# EAGLE schematic basicUno (EAGLE 6.5.0)
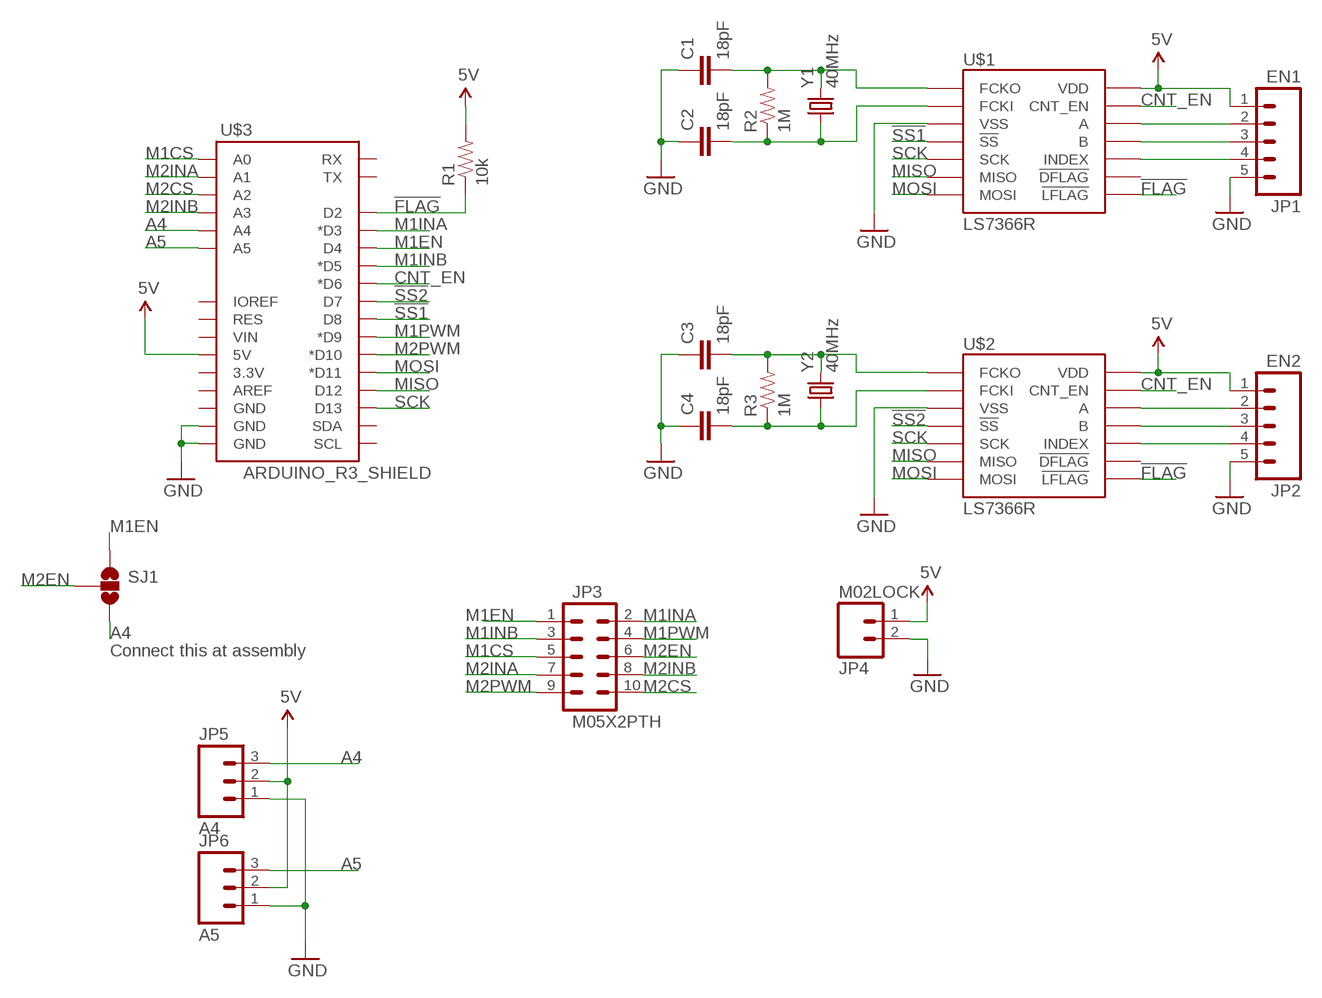
[diagram p0: schematic, sheet 1]

## Parts
C1  18pF  CAP0603-CAP  [0603-CAP]
C2  18pF  CAP0603-CAP  [0603-CAP]
C3  18pF  CAP0603-CAP  [0603-CAP]
C4  18pF  CAP0603-CAP  [0603-CAP]
JP1  EN1  M05LOCK  [1X05_LOCK]
JP2  EN2  M05LOCK  [1X05_LOCK]
JP3  M05X2PTH  [AVR_ICSP]
JP4  M02LOCK  [1X02_LOCK]
JP5  A4  M03LOCK  [1X03_LOCK]
JP6  A5  M03LOCK  [1X03_LOCK]
R1  10k  RESISTORPTH-1/4W  [AXIAL-0.4]
R2  1M  RESISTOR0603-RES  [0603-RES]
R3  1M  RESISTOR0603-RES  [0603-RES]
SJ1  SOLDERJUMPER_2WAYT  [SJ_2]
U$1  LS7366R  [SOIC14]
U$2  LS7366R  [SOIC14]
U$3  ARDUINO_R3_SHIELD  [UNO_R3_SHIELD]
Y1  40MHz  CRYSTAL5X3  [CRYSTAL-SMD-5X3]
Y2  40MHz  CRYSTAL5X3  [CRYSTAL-SMD-5X3]

## Nets
5V: JP1.1 JP2.1 JP4.1 JP5.2 JP6.2 R1.P$2 U$1.14(VDD) U$2.14(VDD) U$3.5V
!FLAG: R1.P$1 U$1.8(!LFLAG) U$2.8(!LFLAG) U$3.D2
!SS1: U$1.4(!SS) U$3.D8
!SS2: U$2.4(!SS) U$3.D7
A4: JP5.3 SJ1.3 U$3.A4
A5: JP6.3 U$3.A5
CNT_EN: U$1.13(CNT_EN) U$2.13(CNT_EN) U$3.D6(*D6)
GND: C1.1 C2.1 C3.1 C4.1 JP1.5 JP2.5 JP4.2 JP5.1 JP6.1 U$1.3(VSS) U$2.3(VSS) U$3.GND@0(GND) U$3.GND@1(GND)
M1CS: JP3.5 U$3.A0
M1EN: JP3.1 SJ1.1 U$3.D4
M1INA: JP3.2 U$3.D3(*D3)
M1INB: JP3.3 U$3.D5(*D5)
M1PWM: JP3.4 U$3.D9(*D9)
M2CS: JP3.10 U$3.A2
M2EN: JP3.6 SJ1.2
M2INA: JP3.7 U$3.A1
M2INB: JP3.8 U$3.A3
M2PWM: JP3.9 U$3.D10(*D10)
MISO: U$1.6(MISO) U$2.6(MISO) U$3.D12
MOSI: U$1.7(MOSI) U$2.7(MOSI) U$3.D11(*D11)
N$1: JP1.2 U$1.12(A)
N$2: JP1.3 U$1.11(B)
N$3: JP1.4 U$1.10(INDEX)
N$5: JP2.2 U$2.12(A)
N$6: JP2.3 U$2.11(B)
N$7: JP2.4 U$2.10(INDEX)
N$8: C1.2 R2.2 U$1.1(FCKO) Y1.3
N$9: C2.2 R2.1 U$1.2(FCKI) Y1.1
N$12: C3.2 R3.2 U$2.1(FCKO) Y2.3
N$13: C4.2 R3.1 U$2.2(FCKI) Y2.1
SCK: U$1.5(SCK) U$2.5(SCK) U$3.D13
Unconnected: U$1.9(!DFLAG) U$2.9(!DFLAG) U$3.3.3V U$3.AREF U$3.GND@2(GND) U$3.IOREF U$3.RES U$3.RX U$3.SCL U$3.SDA U$3.TX U$3.VIN

## Notes on the sheet
- Connect this at assembly

## Library data of the parts
C1-C4 = SparkFun-Passives:CAP: Capacitor Standard 0603 ceramic capacitor, and 0.1" leaded capacitor.
JP1 JP2 = SparkFun-Connectors:M05: Header 5 Standard 5-pin 0.1" header. Use with straight break away headers (SKU : PRT-00116), right angle break away headers (PRT-00553), swiss pins (PRT-00743), machine pins (PRT-00117), and female headers (PRT-00115). Molex polarized connector foot print use with SKU : PRT-08230 with associated crimp pins and housings.
JP3 = SparkFun-Connectors:M05X2: Header 5x2 Standard 10-pin dual row 0.1" header. Commonly used with AVR-ISP. Use with Spark Fun Electronics SKU: PRT-00778
JP4 = SparkFun-Connectors:M02: Standard 2-pin 0.1" header. Use with - straight break away headers ( PRT-00116) - right angle break away headers (PRT-00553) - swiss pins (PRT-00743) - machine pins (PRT-00117) - female headers (PRT-00115) Molex polarized connector foot print use with: PRT-08233 with associated crimp pins and housings. 2.54_SCREWTERM for use with PRT-10571. 3.5mm Screw Terminal footprints for PRT-08084 5mm Screw Terminal footprints for use with PRT-08433
JP5 JP6 = SparkFun-Connectors:M03: Header 3 Standard 3-pin 0.1" header. Use with straight break away headers (SKU : PRT-00116), right angle break away headers (PRT-00553), swiss pins (PRT-00743), machine pins (PRT-00117), and female headers (PRT-00115). Molex polarized connector foot print use with SKU : PRT-08232 with associated crimp pins and housings.
R1-R3 = SparkFun-Passives:RESISTOR: Resistor Basic schematic elements and footprints for 0603, 1206, and PTH resistors.
SJ1 = SparkFun-Passives:SOLDERJUMPER_2WAY: Solder Jumper 2 way solder jumper
U$1 U$2 = dCustom:LS7366R
U$3 = SparkFun-Boards:ARDUINO_R3_SHIELD: Shield form compatible with the Arduino Uno R3.
Y1 Y2 = SparkFun-FreqCtrl:CRYSTAL: Various standard crystals. Proven footprints. Spark Fun Electronics SKU : COM-00534